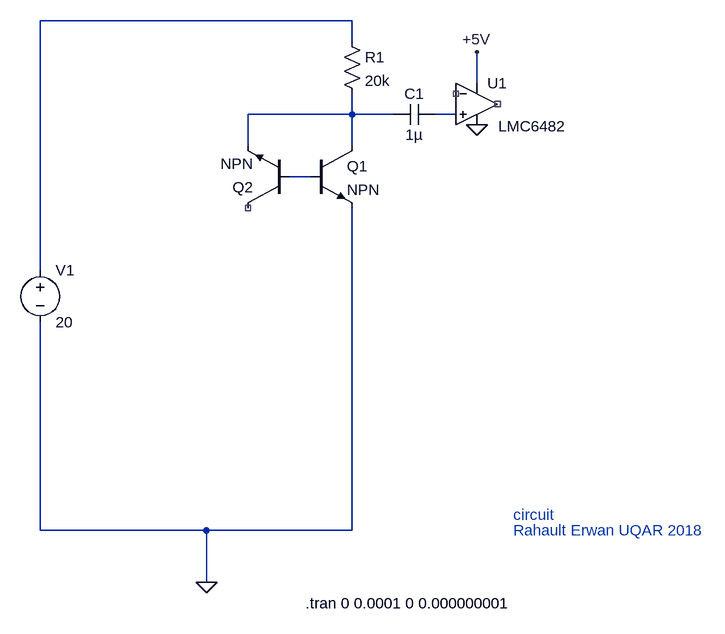
[diagram p0: schematic Noise_gen4.asc]
Noise_gen4.asc, the LTspice schematic file:
Version 4
SHEET 1 1824 680
WIRE 528 -240 48 -240
WIRE 528 -208 528 -240
WIRE 720 -144 720 -192
WIRE 528 -96 528 -128
WIRE 528 -96 368 -96
WIRE 592 -96 528 -96
WIRE 688 -96 656 -96
WIRE 368 -48 368 -96
WIRE 528 -48 528 -96
WIRE 464 0 432 0
WIRE 48 144 48 -240
WIRE 48 544 48 224
WIRE 304 544 48 544
WIRE 528 544 528 48
WIRE 528 544 304 544
WIRE 304 624 304 544
FLAG 304 624 0
FLAG 720 -192 +5V
FLAG 720 -80 0
SYMBOL npn 464 -48 R0
SYMATTR InstName Q1
SYMBOL npn 432 48 R180
SYMATTR InstName Q2
SYMBOL res 512 -224 R0
SYMATTR InstName R1
SYMATTR Value 20k
SYMBOL voltage 48 128 R0
WINDOW 123 0 0 Left 2
WINDOW 39 0 0 Left 2
SYMATTR InstName V1
SYMATTR Value 20
SYMBOL cap 656 -112 R90
WINDOW 0 0 32 VBottom 2
WINDOW 3 32 32 VTop 2
SYMATTR InstName C1
SYMATTR Value 1µ
SYMBOL Opamps\\opamp2 720 -176 R0
WINDOW 3 33 98 Left 2
SYMATTR InstName U1
SYMATTR Value LMC6482
TEXT 456 656 Left 2 !.tran 0 0.0001 0 0.000000001
TEXT 776 544 Left 2 ;Rahault Erwan UQAR 2018
TEXT 776 520 Left 2 ;circuit

The netlist it stands for:
* Noise_gen4.asc
Q1 N002 N004 0 0 NPN
Q2 NC_01 N004 N002 0 NPN
R1 N001 N002 20k
V1 N001 0 20
C1 N003 N002 1µ
XU1 N003 NC_02 +5V 0 NC_03 LMC6482  ; pins In+ In- V+ V- OUT
.model NPN NPN
.model PNP PNP
.lib standard.bjt
.tran 0 0.0001 0 0.000000001
* Rahault Erwan UQAR 2018
* circuit
.backanno
.end